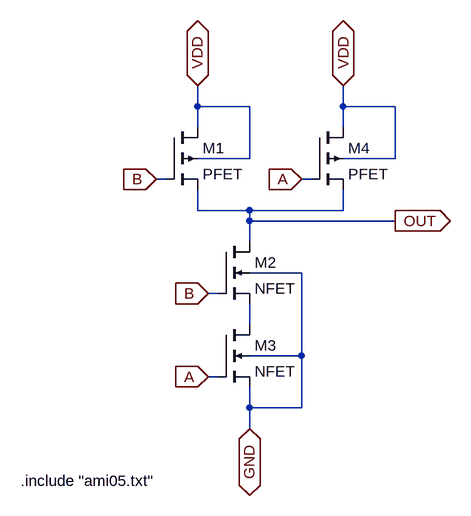
[diagram p0: schematic NAND.asc]
NAND.asc, the LTspice schematic file:
Version 4
SHEET 1 880 680
WIRE 32 -96 32 -128
WIRE 112 -96 32 -96
WIRE 256 -96 256 -128
WIRE 336 -96 256 -96
WIRE 32 -64 32 -96
WIRE 256 -64 256 -96
WIRE 112 -16 112 -96
WIRE 112 -16 32 -16
WIRE 336 -16 336 -96
WIRE 336 -16 256 -16
WIRE -16 16 -32 16
WIRE 208 16 192 16
WIRE 32 64 32 32
WIRE 112 64 32 64
WIRE 256 64 256 32
WIRE 256 64 112 64
WIRE 112 80 112 64
WIRE 336 80 112 80
WIRE 112 112 112 80
WIRE 192 160 112 160
WIRE 64 192 48 192
WIRE 112 240 112 208
WIRE 192 288 192 160
WIRE 192 288 112 288
WIRE 64 320 48 320
WIRE 112 368 112 336
WIRE 192 368 192 288
WIRE 192 368 112 368
WIRE 112 400 112 368
FLAG 112 400 GND
IOPIN 112 400 BiDir
FLAG 32 -128 VDD
IOPIN 32 -128 BiDir
FLAG 256 -128 VDD
IOPIN 256 -128 BiDir
FLAG 192 16 A
IOPIN 192 16 In
FLAG 48 320 A
IOPIN 48 320 In
FLAG 48 192 B
IOPIN 48 192 In
FLAG -32 16 B
IOPIN -32 16 In
FLAG 336 80 OUT
IOPIN 336 80 Out
SYMBOL pmos4 -16 -64 R0
SYMATTR InstName M1
SYMATTR Value2 l=600n w=3u
SYMATTR Value PFET
SYMBOL nmos4 64 112 R0
SYMATTR InstName M2
SYMATTR Value2 l=600n w=3u
SYMATTR Value NFET
SYMBOL nmos4 64 240 R0
SYMATTR InstName M3
SYMATTR Value2 l=600n w=3u
SYMATTR Value NFET
SYMBOL pmos4 208 -64 R0
SYMATTR InstName M4
SYMATTR Value2 l=600n w=3u
SYMATTR Value PFET
TEXT -240 480 Left 2 !.include "ami05.txt"

The netlist it stands for:
* NAND.asc
M1 VDD B OUT VDD PFET l=600n w=3u
M2 OUT B N001 GND NFET l=600n w=3u
M3 N001 A GND GND NFET l=600n w=3u
M4 VDD A OUT VDD PFET l=600n w=3u
.model NMOS NMOS
.model PMOS PMOS
.lib standard.mos
.include "ami05.txt"
.backanno
.end